# Altium schematic sheet tuch-tara2.SchDoc
size A3
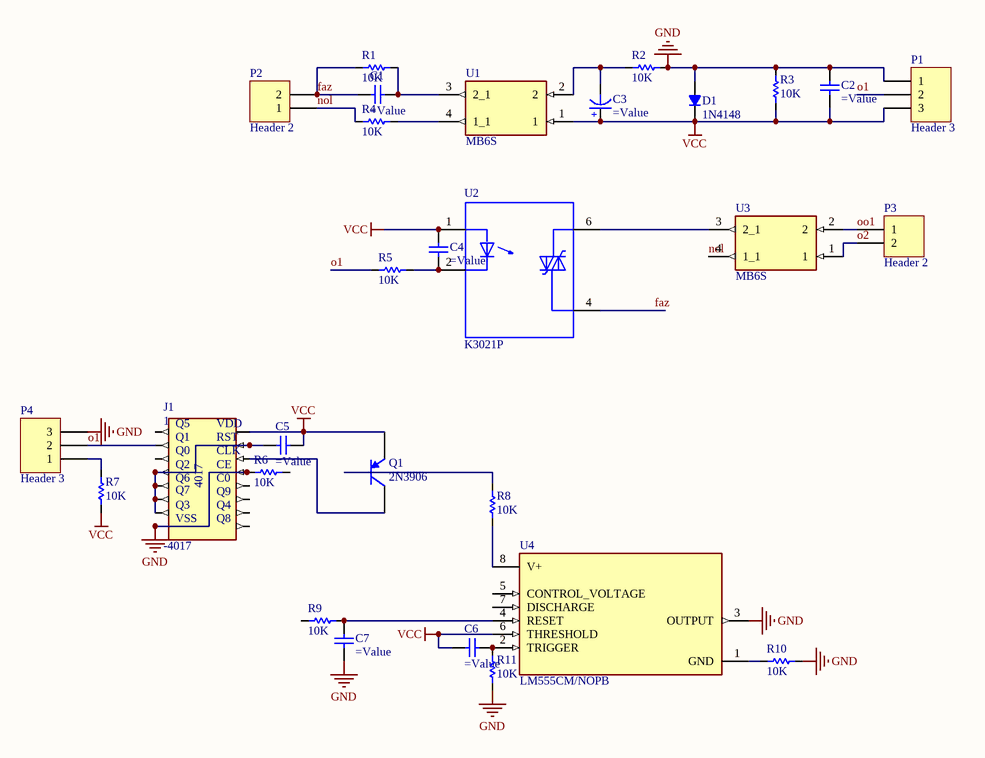
[diagram p0: tuch-tara2.SchDoc]

## Parts
C1  (no value)  [CAP-30]
C2  (no value)  [CAP 1206]
C3  (no value)  [ELEC-CAP-RAD10-20]
C4  (no value)  [CAP 1206]
C5  (no value)  [CAP 1206]
C6  (no value)  [CAP 1206]
C7  (no value)  [CAP 1206]
D1  MODEL: 1N4148  [DO-41]  (hidden comment: MODEL)
J1  -4017  [SOIC127P600X175-16N]
P1  Header 3  [HDR1X3]
P2  Header 2  [HDR1X2]
P3  Header 2  [HDR1X2]
P4  Header 3  [HDR1X3]
Q1  2N3906  [SOT23-3]
R1  10K  [RES 1206 (3216X08L)]
R2  10K  [RES 1206 (3216X08L)]
R3  10K  [RES 1206 (3216X08L)]
R4  10K  [RES 2512 (6331X07L)]
R5  10K  [RES 1206 (3216X08L)]
R6  10K  [RES 1206 (3216X08L)]
R7  10K  [Res-(1/4)]
R8  10K  [RES 1206 (3216X08L)]
R9  10K  [RES 1206 (3216X08L)]
R10  10K  [RES 1206 (3216X08L)]
R11  10K  [RES 1206 (3216X08L)]
U1  MB6S  [SOIC245P670X270-4N]
U2  K3021P  [DIP762W50P254L730H410Q6]
U3  MB6S  [SOIC245P670X270-4N]
U4  LM555CM/NOPB  [SOIC127P599X175-8N]

## Nets
GND: C2.2(-) C7.2(-) D1.1(A) J1.8(VSS) J1.13(CE) P1.1 P4.3 R2.2 R3.2 R6.1 R10.2 R11.1 U4.3(OUTPUT)
VCC: C2.1(+) C3.2(+) C4.2(-) C5.1(+) C6.2(-) D1.2(K) J1.16(VDD) P1.3 Q1.1(E) R3.1 R7.1 U1.1 U2.1(A) U4.6(THRESHOLD)
faz: C1.1(+) P2.2 R1.2 U2.4(MT1)
nol: P2.1 R4.2 U3.4(1_1)
o1: J1.2(Q1) P1.2 P4.2 R5.1
o2: P3.2 U3.1
oo1: P3.1 U3.2
NetC1_2: C1.2(-) R1.1 U1.3(2_1)
NetC3_1: C3.1(-) R2.1 U1.2
NetC4_1: C4.1(+) R5.2 U2.2(C)
NetC5_2: C5.2(-) J1.4(Q2) J1.5(Q6) J1.6(Q7) J1.7(Q3) J1.15(RST)
NetC6_1: C6.1(+) R11.2 U4.2(TRIGGER)
NetC7_1: C7.1(+) R9.2 U4.4(RESET)
NetJ1_14: J1.14(CLK) Q1.3(C)
NetP4_1: P4.1 R7.2
NetQ1_2: Q1.2(B) R8.2
NetR4_1: R4.1 U1.4(1_1)
NetR8_1: R8.1 U4.8(V+)
NetR10_1: R10.1 U4.1(GND)
NetU2_6: U2.6(MT2) U3.3(2_1)

Not connected (* = marked no-connect by the designer): J1 1(Q5) 3(Q0) 9(Q8) 10(Q4) 11(Q9) 12(C0); R6 2; R9 1; U4 5(CONTROL_VOLTAGE) 7(DISCHARGE)

## Library data of the parts
C1 C2 C4-C7 = Capacitor
C3 = Capacitor Electrolytic: Electrolytic Capacitor
D1 = Diode
J1 = -4017: 10000pF Â±1% 25V Ceramic Capacitor C0G, NP0 0603 (1608 Metric); MF: Heyco; MP: 4017; Mouser-Purchase-URL: https://snapeda.com/shop?store=Mouser&id=51486; Package: 0603 Heyco; Value: *; Price: None; Availability: Warning; SnapEDA_Link: https://www.snapeda.com/parts/4017/Heyco/view-part/51486/?ref=snap
P1 P4 = Header 3: Header, 3-Pin; LatestRevisionDate: 17-Jul-2002; LatestRevisionNote: Re-released for DXP Platform.; Publisher: Altium Limited
P2 P3 = Header 2: Header, 2-Pin; LatestRevisionDate: 17-Jul-2002; LatestRevisionNote: Re-released for DXP Platform.; Publisher: Altium Limited
Q1 = 2N3906: PNP General Purpose Amplifier; pin to pad: 1>2 2>1; Published: 8-Jun-2000; LatestRevisionDate: 15-Jan-2003; LatestRevisionNote: PCB Footprint 'BCY-W3/D4.7' replaced; DatasheetVersion: 1997; PackageVersion: Sep-1998; PackageReference: TO-92A; Publisher: Altium Limited; PackageDescription: TO, Flat Index; 3 In-Line, Axial Leads; Body Dia. 4.5mm; Leads 0.51 x 0.48 mm (max); ComponentLink1Description: Manufacturer Link; ComponentLink1URL: http://www.fairchildsemi.com/; ComponentLink2Description: Datasheet; ComponentLink2URL: http://www.fairchildsemi.com/ds/2N%2F2N3906.pdf
R1-R11 = Resistor: Tolerance: 5%; Power: 1/4 W; Value: 10K
U1 U3 = MB6S: Bridge Rectifier Single Phase Standard 600V Surface Mount 4-SOIC; MF: ON Semiconductor; Digi-Key_Purchase_URL: https://www.digikey.com.tr/product-detail/en/on-semiconductor/MB6S/MB6SCT-ND/965654?utm_source=snapeda&utm_medium=aggregator&utm_campaign=symbol; Value: *; Package: BESOP-4 Surge Components; Digi-Key_Part_Number: MB6SCT-ND; SnapEDA_Link: https://www.snapeda.com/parts/MB6S/ON%20Semiconductor/view-part/2774209/?ref=snap; MP: MB6S
U2 = K3021P: Optoisolator Triac Output 5300Vrms 1 Channel 6-DIP; MF: Vishay Semiconductor; Package: DIP-6 Vishay; Availability: Unavailable; Value: *; MP: K3021P; Mouser-Purchase-URL: https://snapeda.com/shop?store=Mouser&id=291595; SnapEDA_Link: https://www.snapeda.com/parts/K3021P/Vishay%20Semiconductor%20Opto%20Division/view-part/291595/?ref=snap; Price: None; DigiKey-Purchase-URL: https://snapeda.com/shop?store=DigiKey&id=291595
U4 = LM555CM/NOPB: Highly Stable 555 Timer 8-SOIC 0 to 70; Price: None; MP: LM555CM/NOPB; Availability: Unavailable; Value: *; Package: None